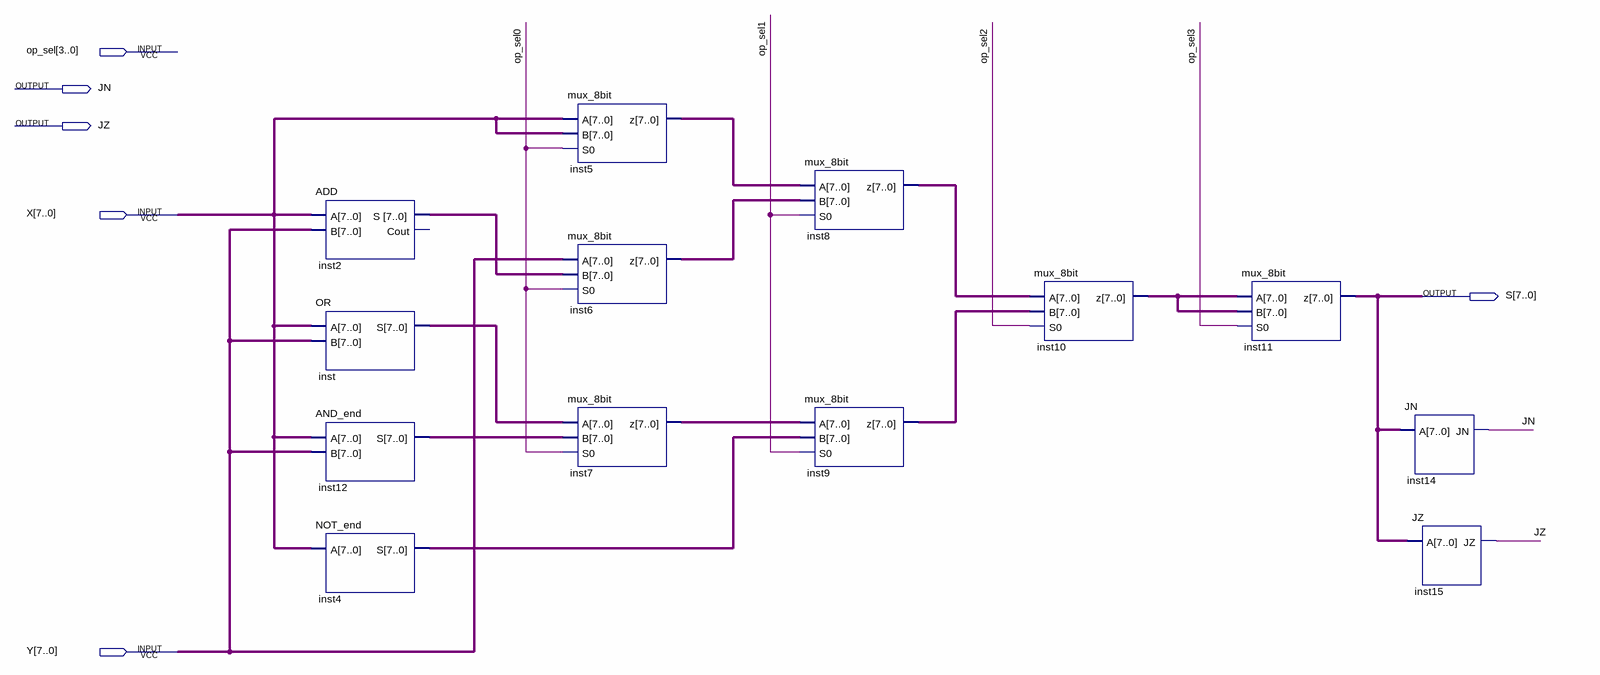
[diagram p0: schematic sheet]
// Quartus schematic ULA.bdf as structural Verilog: 13 symbols, 6 pins
module ULA (
  input  [3:0] op_sel,
  input  [7:0] X,
  input  [7:0] Y,
  output JN,
  output JZ,
  output [7:0] S
);

  wire [7:0] inst2_s, inst4_s, inst5_z, inst6_z, inst7_z, inst8_z, inst9_z, inst10_z, inst12_s, inst_s;

  ADD inst2 (.A(X), .B(Y), .S(inst2_s));  // open: Cout
  OR inst (.A(X), .B(Y), .S(inst_s));
  AND_end inst12 (.A(X), .B(Y), .S(inst12_s));
  NOT_end inst4 (.A(X), .S(inst4_s));
  mux_8bit inst5 (.A(X), .B(X), .S0(op_sel[0]), .z(inst5_z));
  mux_8bit inst6 (.A(Y), .B(inst2_s), .S0(op_sel[0]), .z(inst6_z));
  mux_8bit inst7 (.A(inst_s), .B(inst12_s), .S0(op_sel[0]), .z(inst7_z));
  mux_8bit inst8 (.A(inst5_z), .B(inst6_z), .S0(op_sel[1]), .z(inst8_z));
  mux_8bit inst9 (.A(inst7_z), .B(inst4_s), .S0(op_sel[1]), .z(inst9_z));
  mux_8bit inst10 (.A(inst8_z), .B(inst9_z), .S0(op_sel[2]), .z(inst10_z));
  mux_8bit inst11 (.A(inst10_z), .B(inst10_z), .S0(op_sel[3]), .z(S));
  JN inst14 (.A(S), .JN(JN));
  JZ inst15 (.A(S), .JZ(JZ));
endmodule
